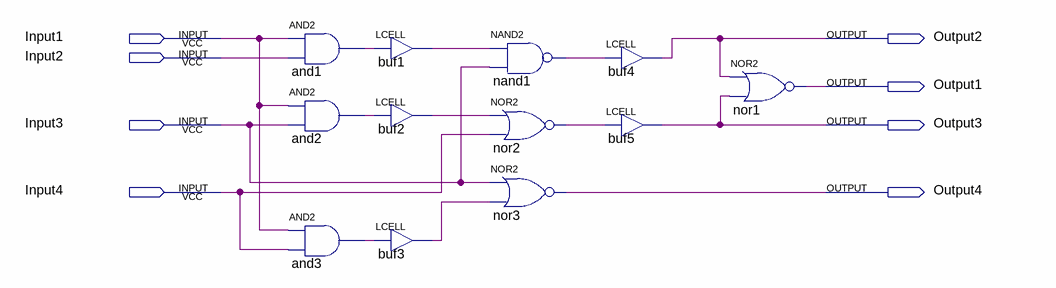
[diagram p0: schematic sheet]
// Quartus schematic elaborate_rcf.bdf as structural Verilog: 12 symbols, 8 pins
module elaborate_rcf (
  input  Input1,
  input  Input2,
  input  Input3,
  input  Input4,
  output Output2,
  output Output1,
  output Output3,
  output Output4
);

  wire and1_out, and2_out, and3_out, buf1_out, buf2_out, buf3_out, nand1_out, nor2_out;

  and and1 (and1_out, Input1, Input2);
  and and2 (and2_out, Input1, Input3);
  and and3 (and3_out, Input1, Input4);
  LCELL buf1 (.IN(and1_out), .OUT(buf1_out));
  LCELL buf2 (.IN(and2_out), .OUT(buf2_out));
  LCELL buf3 (.IN(and3_out), .OUT(buf3_out));
  nand nand1 (nand1_out, buf1_out, Input3);
  nor nor2 (nor2_out, buf2_out, Input4);
  nor nor3 (Output4, Input3, buf3_out);
  LCELL buf4 (.IN(nand1_out), .OUT(Output2));
  LCELL buf5 (.IN(nor2_out), .OUT(Output3));
  nor nor1 (Output1, Output2, Output3);
endmodule
